# EAGLE schematic DIDV_-_Conector_DIDV_BEEB (EAGLE 6.2)

## Sheet 1 of 2
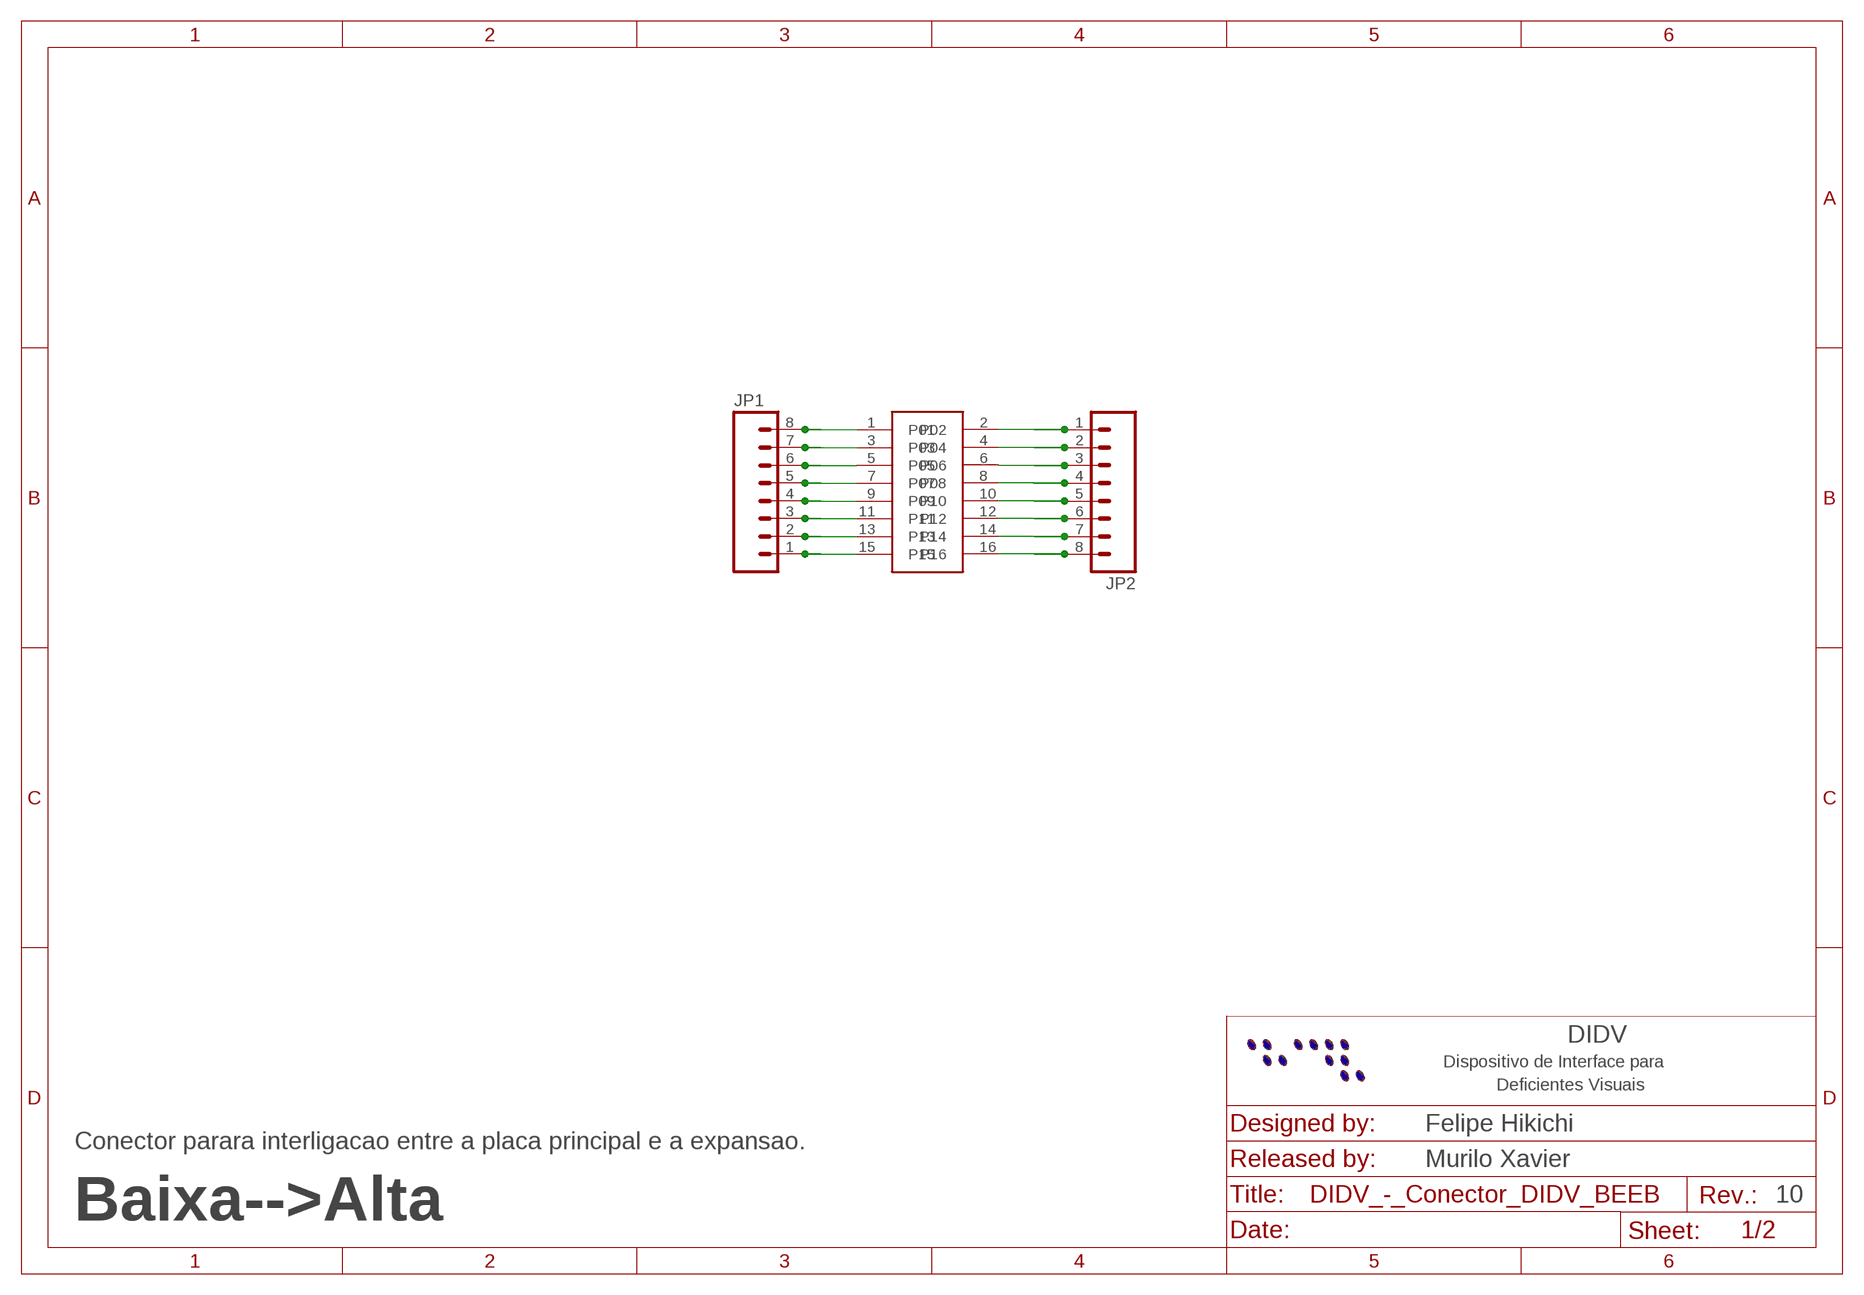
[diagram p0: schematic, sheet 1]

### Parts
JP1  M08LONGPADS  [1X08_LONGPADS]
JP2  M08LONGPADS  [1X08_LONGPADS]
X1  SMDTOP-16  [SMDTOP16]

### Nets
N$1: JP1.8 X1.1(P01)
N$2: JP1.1 X1.15
N$3: JP1.7 X1.3(P03)
N$4: JP1.6 X1.5(P05)
N$5: JP1.5 X1.7(P07)
N$6: JP1.2 X1.13
N$7: JP1.3 X1.11
N$8: JP1.4 X1.9(P09)
N$9: JP2.7 X1.14
N$12: JP2.6 X1.12
N$13: JP2.5 X1.10
N$14: JP2.2 X1.4(P04)
N$15: JP2.3 X1.6(P06)
N$16: JP2.4 X1.8(P08)
N$33: JP2.1 X1.2(P02)
N$34: JP2.8 X1.16

### Notes on the sheet
- DIDV
- Dispositivo de Interface para
- Deficientes Visuais
- Felipe Hikichi
- Conector parara interligacao entre a placa principal e a expansao.
- Murilo Xavier
- 10
- Baixa-->Alta

## Sheet 2 of 2
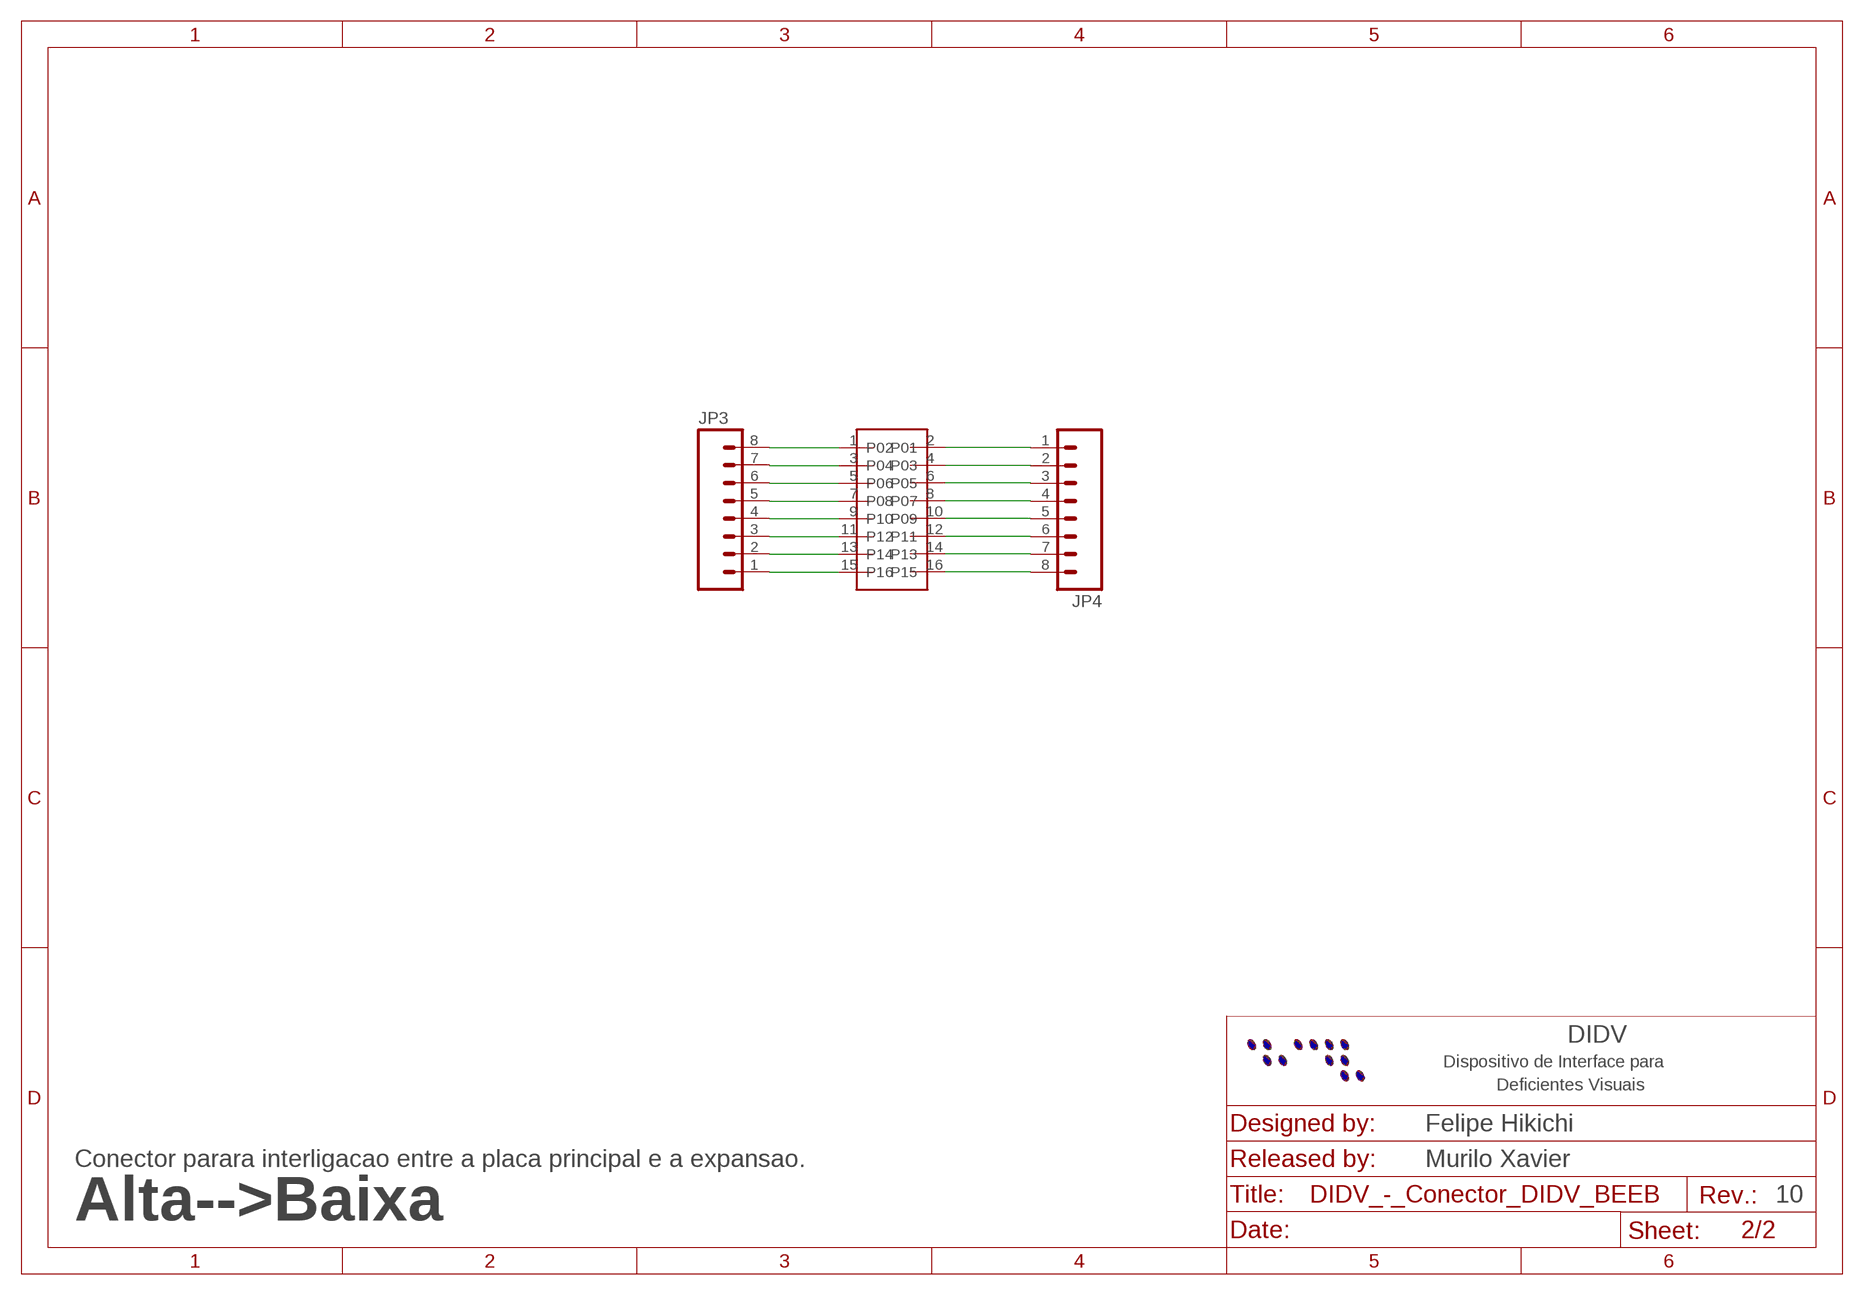
[diagram p1: schematic, sheet 2]

### Parts
JP3  M08LONGPADS  [1X08_LONGPADS]
JP4  M08LONGPADS  [1X08_LONGPADS]
X2  SMDTOP-16  [SMDTOP16]

### Nets
N$10: JP3.7 X2.3(P03)
N$11: JP3.3 X2.11
N$17: JP3.8 X2.1(P01)
N$19: JP3.1 X2.15
N$20: JP3.6 X2.5(P05)
N$21: JP3.5 X2.7(P07)
N$22: JP3.2 X2.13
N$24: JP3.4 X2.9(P09)
N$25: JP4.1 X2.2(P02)
N$26: JP4.8 X2.16
N$27: JP4.7 X2.14
N$28: JP4.6 X2.12
N$29: JP4.5 X2.10
N$30: JP4.2 X2.4(P04)
N$31: JP4.3 X2.6(P06)
N$32: JP4.4 X2.8(P08)

### Notes on the sheet
- DIDV
- Dispositivo de Interface para
- Deficientes Visuais
- Felipe Hikichi
- Conector parara interligacao entre a placa principal e a expansao. | Murilo Xavier
- 10
- Alta-->Baixa

## Library data of the parts
JP1-JP4 = SparkFun-Connectors:M08: Header 8 Standard 8-pin 0.1" header. Use with straight break away headers (SKU : PRT-00116), right angle break away headers (PRT-00553), swiss pins (PRT-00743), machine pins (PRT-00117), and female headers (PRT-00115).
X1 = con-iriso2:SMDTOP-16: AMP connector
X2 = con-iriso1:SMDTOP-16: AMP connector